# Altium schematic sheet RTC.SchDoc
size A4
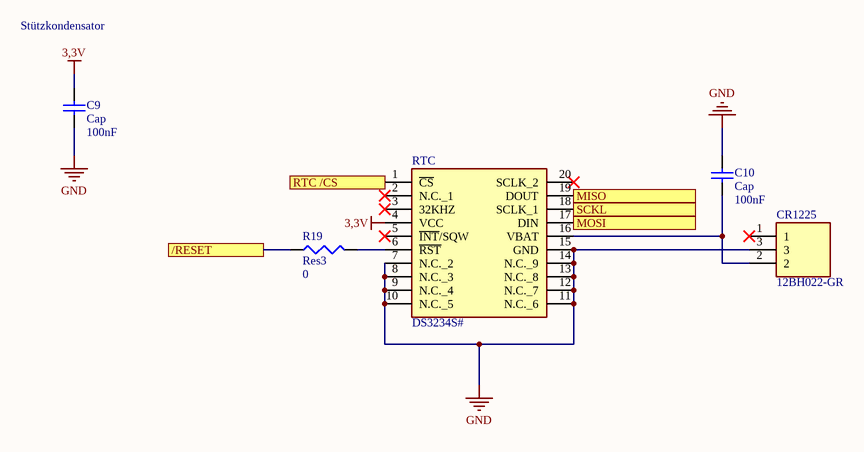
[diagram p0: RTC.SchDoc]

## Parts
C9  Cap  value 100nF  [1608[0603]]
C10  Cap  value 100nF  [1608[0603]]
CR1225  12BH022-GR  [12BH022GR]
R19  Res3  value 0  [J1-0603]
RTC  DS3234S#  [SOIC127P1032X265-20N]

## Ports
/RESET, MISO, MOSI, RTC /CS, SCKL

## Nets
3,3V: C9.2 RTC.4(VCC)
GND: C9.1 C10.2 CR1225.3 RTC.7(N.C._2) RTC.8(N.C._3) RTC.9(N.C._4) RTC.10(N.C._5) RTC.11(N.C._6) RTC.12(N.C._7) RTC.13(N.C._8) RTC.14(N.C._9) RTC.15(GND)
/RESET: R19.1 ; port /RESET
MISO: RTC.19(DOUT) ; port MISO
MOSI: RTC.17(DIN) ; port MOSI
RTC /CS: RTC.1(~{CS}) ; port RTC /CS
SCKL: RTC.18(SCLK_1) ; port SCKL
NetC10_1: C10.1 CR1225.2 RTC.16(VBAT)
NetR19_2: R19.2 RTC.6(~{RST})

Not connected (* = marked no-connect by the designer): CR1225 1*; RTC 2(N.C._1)* 3(32KHZ)* 5(~{INT}/SQW)* 20(SCLK_2)*

## Notes on the sheet
- Stützkondensator

## Library data of the parts
C9 C10 = Cap: Capacitor; Published: 8-Jun-2000; LatestRevisionDate: 17-Jul-2002; LatestRevisionNote: Re-released for DXP Platform.; PackageReference: RAD-0.3; Publisher: Altium Limited; PackageDescription: Radial Cap, Thru-Hole; 2 Leads; 0.3 in Pin Spacing
CR1225 = 12BH022-GR: Hardware; Manufacturer_Name: Eagle Plastic Devices; Datasheet Link: https://componentsearchengine.com//12BH022-GR.pdf; Height: 4mm; Mouser2 Part Number: 12BH022-GR; Mouser2 Price/Stock: https://www.mouser.com/Search/Refine.aspx?Keyword=12BH022-GR; Manufacturer_Part_Number: 12BH022-GR
R19 = Res3: Resistor; Published: 8-Jun-2000; LatestRevisionDate: 29-May-2009; LatestRevisionNote: IPC-7351 Footprint Added.; PackageReference: J1-0603; Publisher: Altium Limited; PackageDescription: Chip Resistor
RTC = DS3234S#: Integrated Circuit; Manufacturer_Name: Maxim Integrated; Datasheet Link: https://componentsearchengine.com//DS3234S#.pdf; Height: 2.65mm; Mouser2 Part Number: 700-DS3234S#; Mouser2 Price/Stock: https://www.mouser.com/Search/Refine.aspx?Keyword=700-DS3234S%23; Manufacturer_Part_Number: DS3234S#